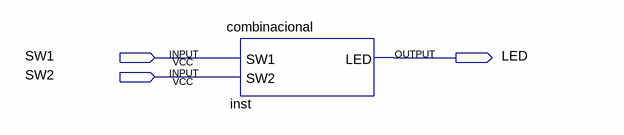
[diagram p0: schematic sheet]
// Quartus schematic esquematico_b.bdf as structural Verilog: 1 symbols, 3 pins
module esquematico_b (
  input  SW1,
  input  SW2,
  output LED
);

  combinacional inst (.SW1(SW1), .SW2(SW2), .LED(LED));
endmodule
